# EAGLE schematic camera_cape (EAGLE 7.2.0)

## Sheet 1 of 2
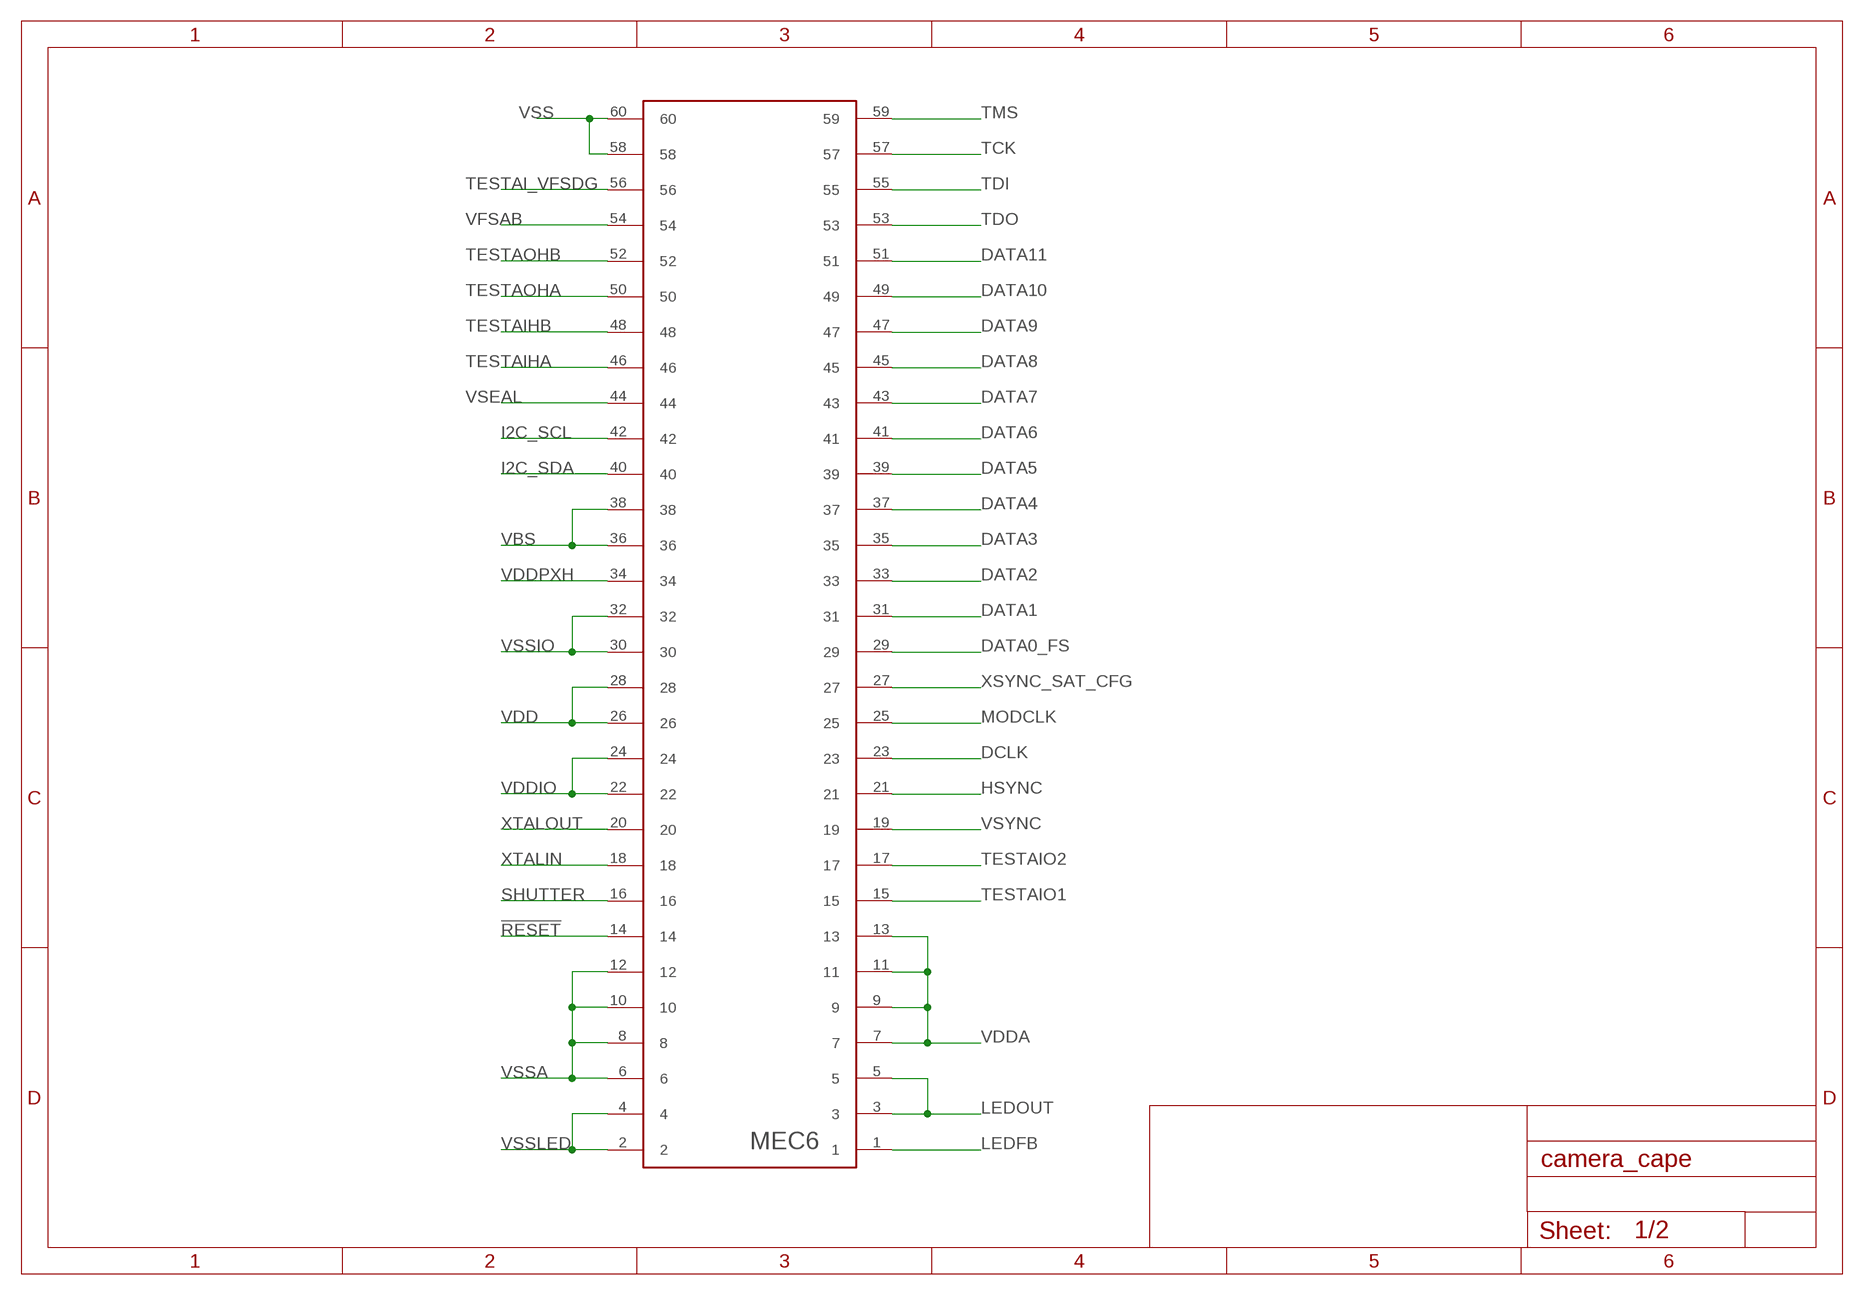
[diagram p0: schematic, sheet 1]

### Parts
J1  MEC6  [MEC6-130-02-X-D-RA1]

### Nets
!RESET: J1.14
DATA0_FS: J1.29
DATA1: J1.31
DATA2: J1.33
DATA3: J1.35
DATA4: J1.37
DATA5: J1.39
DATA6: J1.41
DATA7: J1.43
DATA8: J1.45
DATA9: J1.47
DATA10: J1.49
DATA11: J1.51
DCLK: J1.23
HSYNC: J1.21
I2C_SCL: J1.42
I2C_SDA: J1.40
LEDFB: J1.1
LEDOUT: J1.3 J1.5
MODCLK: J1.25
SHUTTER: J1.16
TCK: J1.57
TDI: J1.55
TDO: J1.53
TESTAI_VFSDG: J1.56
TESTAIHA: J1.46
TESTAIHB: J1.48
TESTAIO1: J1.15
TESTAIO2: J1.17
TESTAOHA: J1.50
TESTAOHB: J1.52
TMS: J1.59
VBS: J1.36 J1.38
VDD: J1.26 J1.28
VDDA: J1.7 J1.9 J1.11 J1.13
VDDIO: J1.22 J1.24
VDDPXH: J1.34
VFSAB: J1.54
VSEAL: J1.44
VSS: J1.58 J1.60
VSSA: J1.6 J1.8 J1.10 J1.12
VSSIO: J1.30 J1.32
VSSLED: J1.2 J1.4
VSYNC: J1.19
XSYNC_SAT_CFG: J1.27
XTALIN: J1.18
XTALOUT: J1.20

## Sheet 2 of 2
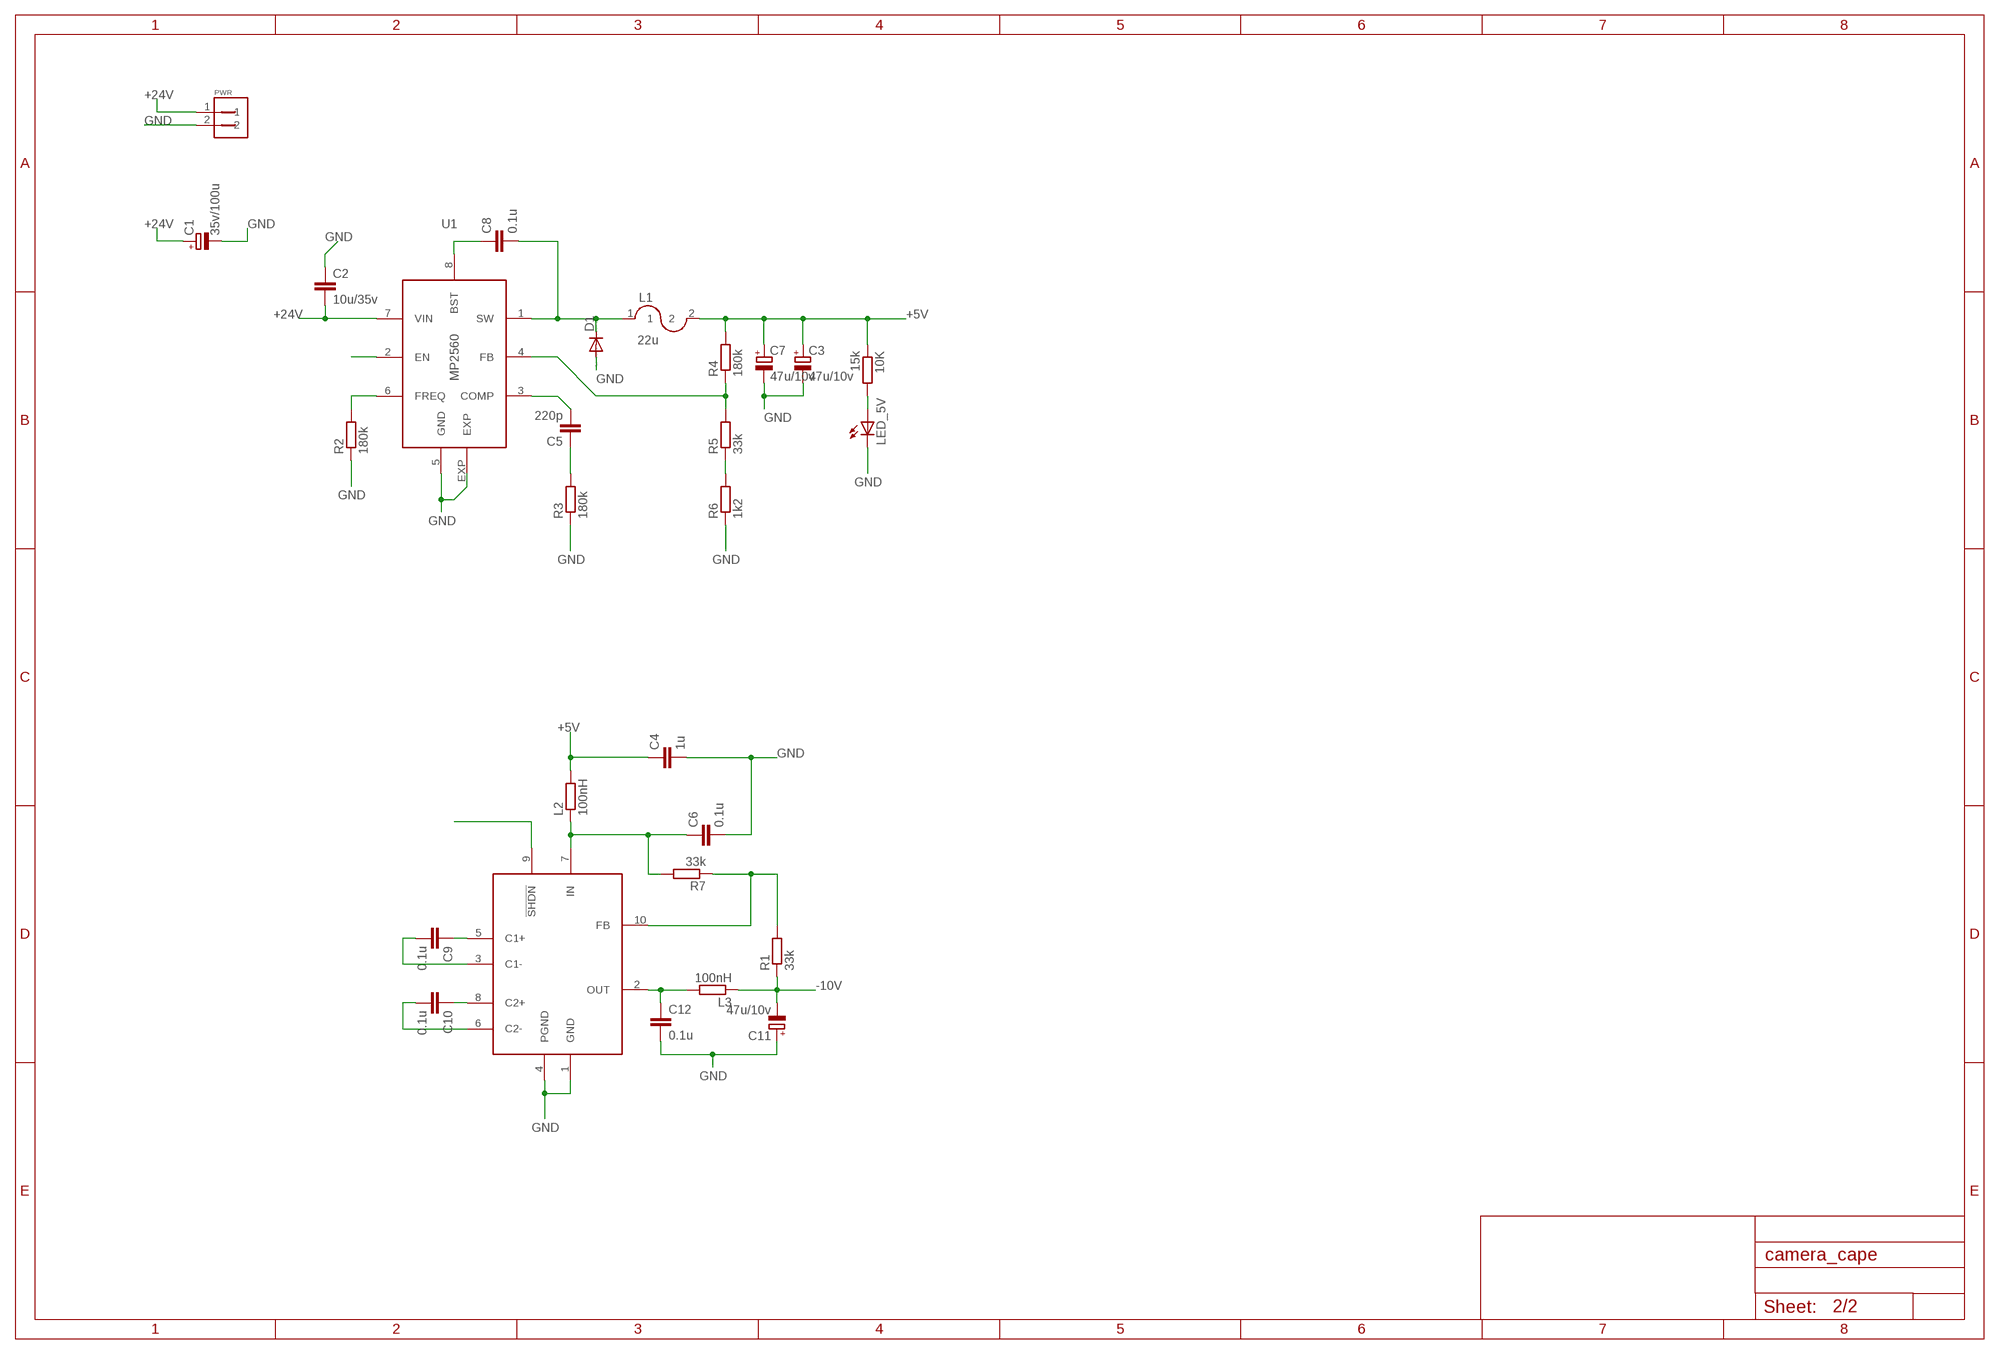
[diagram p1: schematic, sheet 2]

### Parts
10K  15k  R-EU_R0603  [R0603]
C1  35v/100u  CPOL-EU150CLZ-0810  [150CLZ-0810]
C2  10u/35v  C-EUC1206  [C1206]
C3  47u/10v  CPOL-EUCT3528  [CT3528]
C4  1u  C-EUC0603  [C0603]
C5  220p  C-EUC0603  [C0603]
C6  0.1u  C-EUC0603  [C0603]
C7  47u/10v  CPOL-EUCT3528  [CT3528]
C8  0.1u  C-EUC0603  [C0603]
C9  0.1u  C-EUC0603  [C0603]
C10  0.1u  C-EUC0603  [C0603]
C11  47u/10v  CPOL-EUCT3528  [CT3528]
C12  0.1u  C-EUC0603  [C0603]
D1  DIODE-DO214AC  [DO214AC]
L1  22u  RCL_L_CDRH8D38  [RCL_L_CDRH8D38]
L2  100nH  R-EU_R0603  [R0603]
L3  100nH  R-EU_R0603  [R0603]
LED_5V  LEDSML0603  [SML0603]
PWR  CON_MOLEX_MINIFIT_2190  [CON_MOLEX_MINIFIT_2*1]
R1  33k  R-EU_R0603  [R0603]
R2  180k  R-EU_R0603  [R0603]
R3  180k  R-EU_R0603  [R0603]
R4  180k  R-EU_R0603  [R0603]
R5  33k  R-EU_R0603  [R0603]
R6  1k2  R-EU_R0603  [R0603]
R7  33k  R-EU_R0603  [R0603]
U1  MP2560  [SOIC-8E]
U$1  MAX868  [UMAX_10PIN]

### Nets
+5V: 10K.1 C3.+ C4.1 C7.+ L1.2 L2.2 R4.2
+24V: C1.+ C2.2 PWR.1 U1.7(VIN)
-10V: C11.- L3.1 R1.1
GND: C1.- C2.1 C3.- C4.2 C6.2 C7.- C11.+ C12.2 D1.A LED_5V.C PWR.2 R2.1 R3.1 R6.1 U1.5(GND) U1.EXP U$1.1(GND) U$1.4(PGND)
N$1: C8.2 D1.C L1.1 U1.1(SW)
N$2: U1.2(EN)
N$3: C5.1 R3.2
N$4: R2.2 U1.6(FREQ)
N$5: C5.2 U1.3(COMP)
N$6: R5.1 R6.2
N$7: R4.1 R5.2 U1.4(FB)
N$8: C8.1 U1.8(BST)
N$9: 10K.2 LED_5V.A
N$10: U$1.9(!SHDN)
N$11: C9.1 U$1.5(C1+)
N$12: C6.1 L2.1 R7.2 U$1.7(IN)
N$13: C9.2 U$1.3(C1-)
N$14: C10.1 U$1.8(C2+)
N$15: C10.2 U$1.6(C2-)
N$16: C12.1 L3.2 U$1.2(OUT)
N$17: R1.2 R7.1 U$1.10(FB)

## Library data of the parts
10K L2 L3 R1-R7 = rcl:R-EU_: RESISTOR, European symbol
C1 C3 C7 C11 = rcl:CPOL-EU: POLARIZED CAPACITOR, European symbol
C2 C4-C6 C8-C10 C12 = rcl:C-EU: CAPACITOR, European symbol
D1 = diode:DIODE-: DIODE
J1 = mec6:MEC6
L1 = my_rcl:RCL_L_CDRH8D38: http://products.sumida.com/products/pdf/CDRH8D38.pdf
LED_5V = led:LED: LED OSRAM: - CHIPLED LG R971, LG N971, LY N971, LG Q971, LY Q971, LO R971, LY R971 LH N974, LH R974 LS Q976, LO Q976, LY Q976 LO Q996 - Hyper CHIPLED LW Q18S LB Q993, LB Q99A, LB R99A - SideLED LS A670, LO A670, LY A670, LG A670, LP A670 LB A673, LV A673, LT A673, LW A673 LH A674 LY A675 LS A676, LA A676, LO A676, LY A676, LW A676 LS A679, LY A679, LG A679 - Hyper Micro SIDELED® LS Y876, LA Y876, LO Y876, LY Y876 LT Y87S - SmartLED LW L88C, LW L88S LB L89C, LB L89S, LG L890 LS L89K, LO L89K, LY L89K LS L896, LA L896, LO L896, LY L896 - TOPLED LS T670, LO T670, LY T670, LG T670, LP T670 LSG T670, LSP T670, LSY T670, LOP T670, LYG T670 LG T671, LOG T671, LSG T671 LB T673, LV T673, LT T673, LW T673 LH T674 LS T676, LA T676, LO T676, LY T676, LB T676, LH T676, LSB T676, LW T676 LB T67C, LV T67C, LT T67C, LS T67K, LO T67K, LY T67K, LW E67C LS E67B, LA E67B, LO E67B, LY E67B, LB E67C, LV E67C, LT E67C LW T67C LS T679, LY T679, LG T679 LS T770, LO T770, LY T770, LG T770, LP T770 LB T773, LV T773, LT T773, LW T773 LH T774 LS E675, LA E675, LY E675, LS T675 LS T776, LA T776, LO T776, LY T776, LB T776 LHGB T686 LT T68C, LB T68C - Hyper Mini TOPLED® LB M676 - Mini TOPLED Santana® LG M470 LS M47K, LO M47K, LY M47K Source: http://www.osram.convergy.de LUXEON: - LUMILED® LXK2-PW12-R00, LXK2-PW12-S00, LXK2-PW14-U00, LXK2-PW14-V00 LXK2-PM12-R00, LXK2-PM12-S00, LXK2-PM14-U00 LXK2-PE12-Q00, LXK2-PE12-R00, LXK2-PE12-S00, LXK2-PE14-T00, LXK2-PE14-U00 LXK2-PB12-K00, LXK2-PB12-L00, LXK2-PB12-M00, LXK2-PB14-N00, LXK2-PB14-P00, LXK2-PB14-Q00 LXK2-PR12-L00, LXK2-PR12-M00, LXK2-PR14-Q00, LXK2-PR14-R00 LXK2-PD12-Q00, LXK2-PD12-R00, LXK2-PD12-S00 LXK2-PH12-R00, LXK2-PH12-S00 LXK2-PL12-P00, LXK2-PL12-Q00, LXK2-PL12-R00 Source: www.luxeon.com KINGBRIGHT: KA-3528ASYC Source: www.kingbright.com
PWR = my_con:CON_MOLEX_MINIFIT_2*1
U1 = my_ic:MP2560
U$1 = my_ic:MAX868

## Net classes
1 +24V: width 0.254 mm, drill 0.127 mm, clearance 0.254 mm